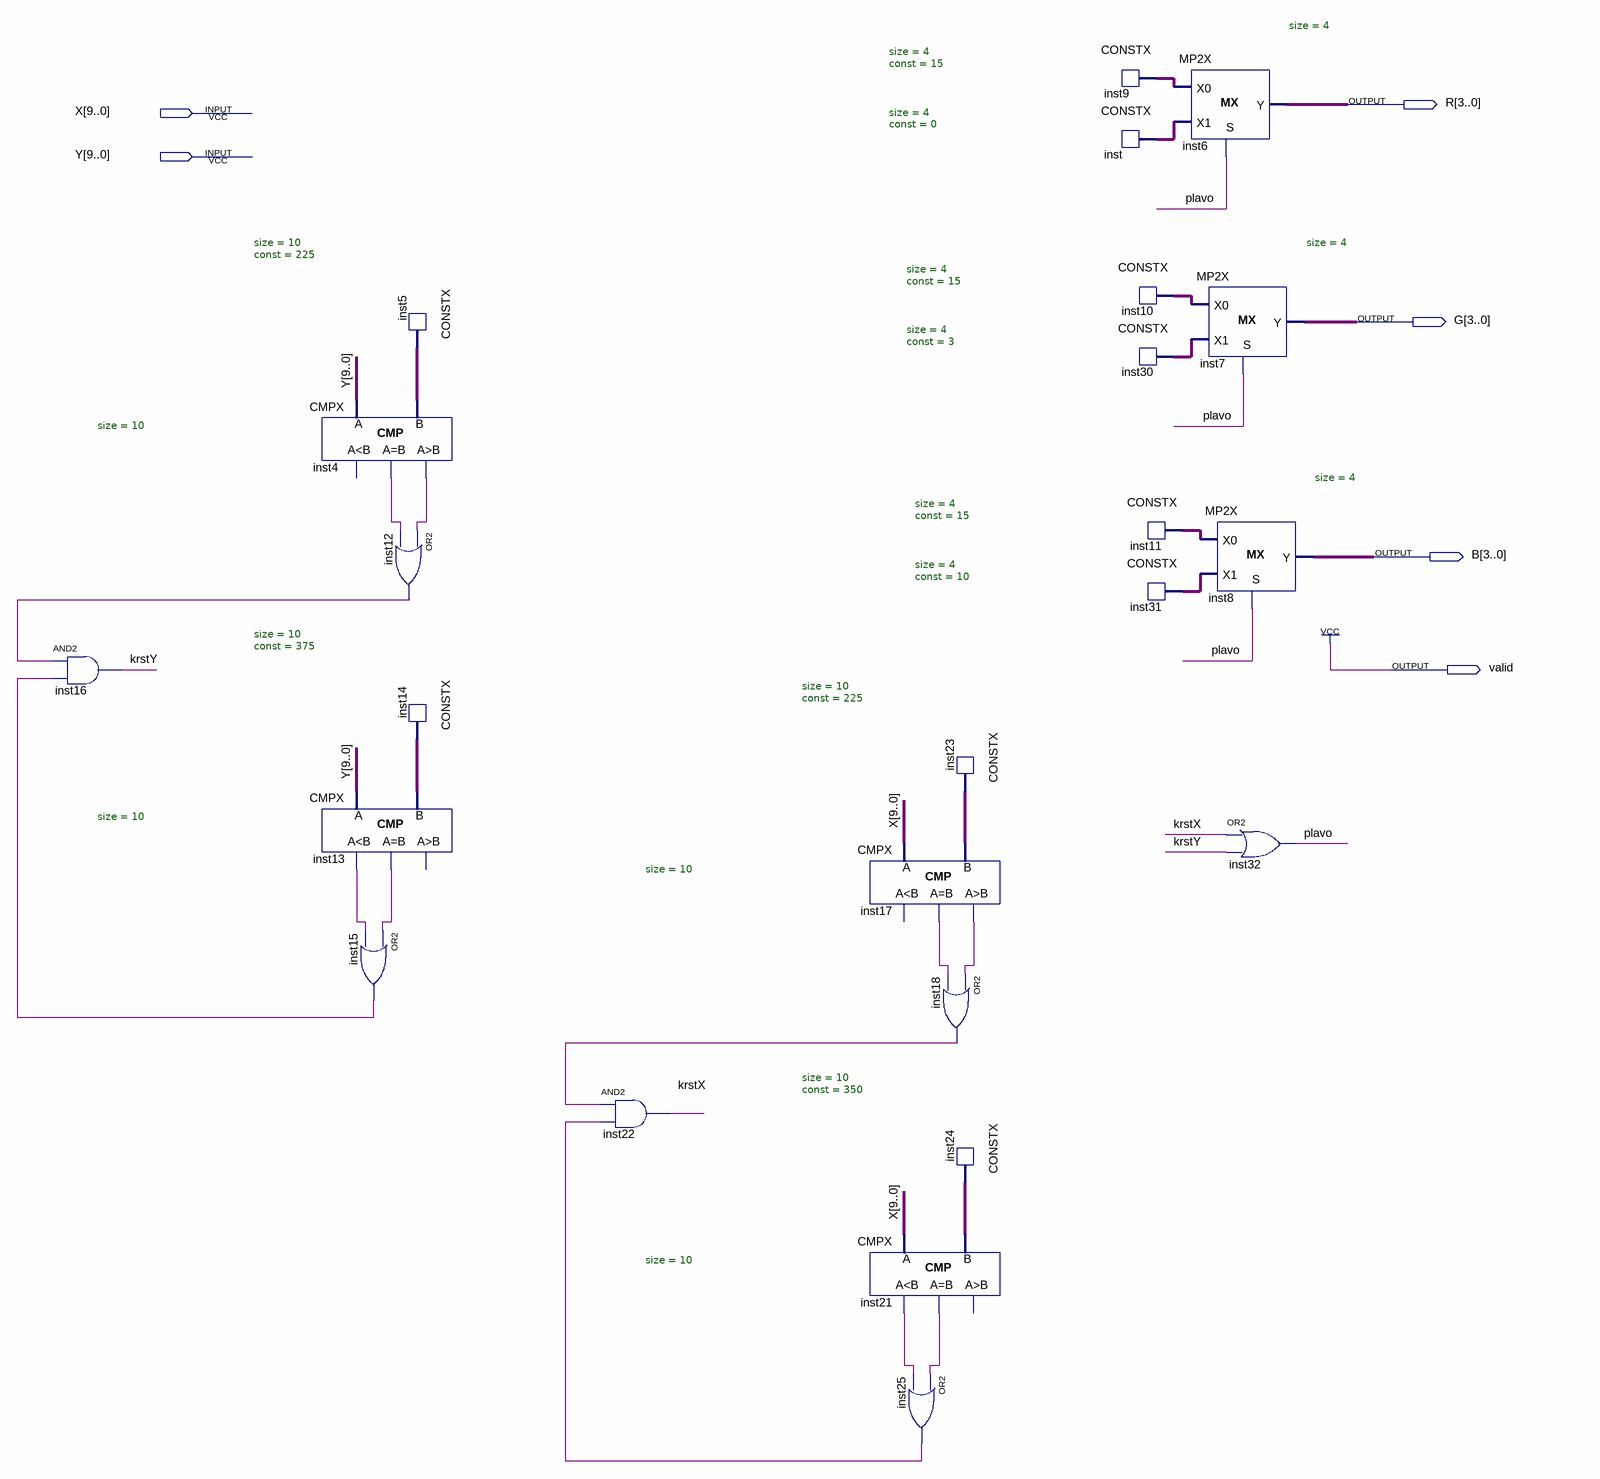
[diagram p0: schematic sheet]
// Quartus schematic Finska.bdf as structural Verilog: 24 symbols, 6 pins
module Finska (
  input  [9:0] X,
  input  [9:0] Y,
  output [3:0] R,
  output [3:0] G,
  output [3:0] B,
  output valid
);

  wire inst4_eq, inst4_gr, inst12_out, inst13_eq, inst13_ls, inst15_out, inst17_eq, inst17_gr, inst18_out,
       inst21_eq, inst21_ls, inst25_out, krstX, krstY, plavo;
  wire [3:0] inst9_data, inst10_data, inst11_data, inst30_data, inst31_data, inst_data;
  wire [9:0] inst5_data, inst14_data, inst23_data, inst24_data;

  and inst16 (krstY, inst12_out, inst15_out);
  CMPX #(.size(10)) inst4 (.A(Y), .B(inst5_data), .eq(inst4_eq), .gr(inst4_gr));  // open: ls
  CMPX #(.size(10)) inst13 (.A(Y), .B(inst14_data), .ls(inst13_ls), .eq(inst13_eq));  // open: gr
  or inst15 (inst15_out, inst13_eq, inst13_ls);
  CONSTX #(.size(10), .\const (225)) inst5 (.data(inst5_data));
  or inst12 (inst12_out, inst4_gr, inst4_eq);
  CONSTX #(.size(10), .\const (375)) inst14 (.data(inst14_data));
  and inst22 (krstX, inst18_out, inst25_out);
  CMPX #(.size(10)) inst17 (.A(X), .B(inst23_data), .eq(inst17_eq), .gr(inst17_gr));  // open: ls
  CMPX #(.size(10)) inst21 (.A(X), .B(inst24_data), .ls(inst21_ls), .eq(inst21_eq));  // open: gr
  or inst25 (inst25_out, inst21_eq, inst21_ls);
  CONSTX #(.size(10), .\const (225)) inst23 (.data(inst23_data));
  or inst18 (inst18_out, inst17_gr, inst17_eq);
  CONSTX #(.size(10), .\const (350)) inst24 (.data(inst24_data));
  CONSTX #(.size(4), .\const (15)) inst9 (.data(inst9_data));
  CONSTX #(.size(4), .\const (0)) inst (.data(inst_data));
  CONSTX #(.size(4), .\const (15)) inst10 (.data(inst10_data));
  CONSTX #(.size(4), .\const (3)) inst30 (.data(inst30_data));
  CONSTX #(.size(4), .\const (15)) inst11 (.data(inst11_data));
  CONSTX #(.size(4), .\const (10)) inst31 (.data(inst31_data));
  MP2X #(.size(4)) inst6 (.S(plavo), .X0(inst9_data), .X1(inst_data), .Y(R));
  MP2X #(.size(4)) inst7 (.S(plavo), .X0(inst10_data), .X1(inst30_data), .Y(G));
  MP2X #(.size(4)) inst8 (.S(plavo), .X0(inst11_data), .X1(inst31_data), .Y(B));
  or inst32 (plavo, krstX, krstY);

  assign valid = 1'b1;
endmodule
